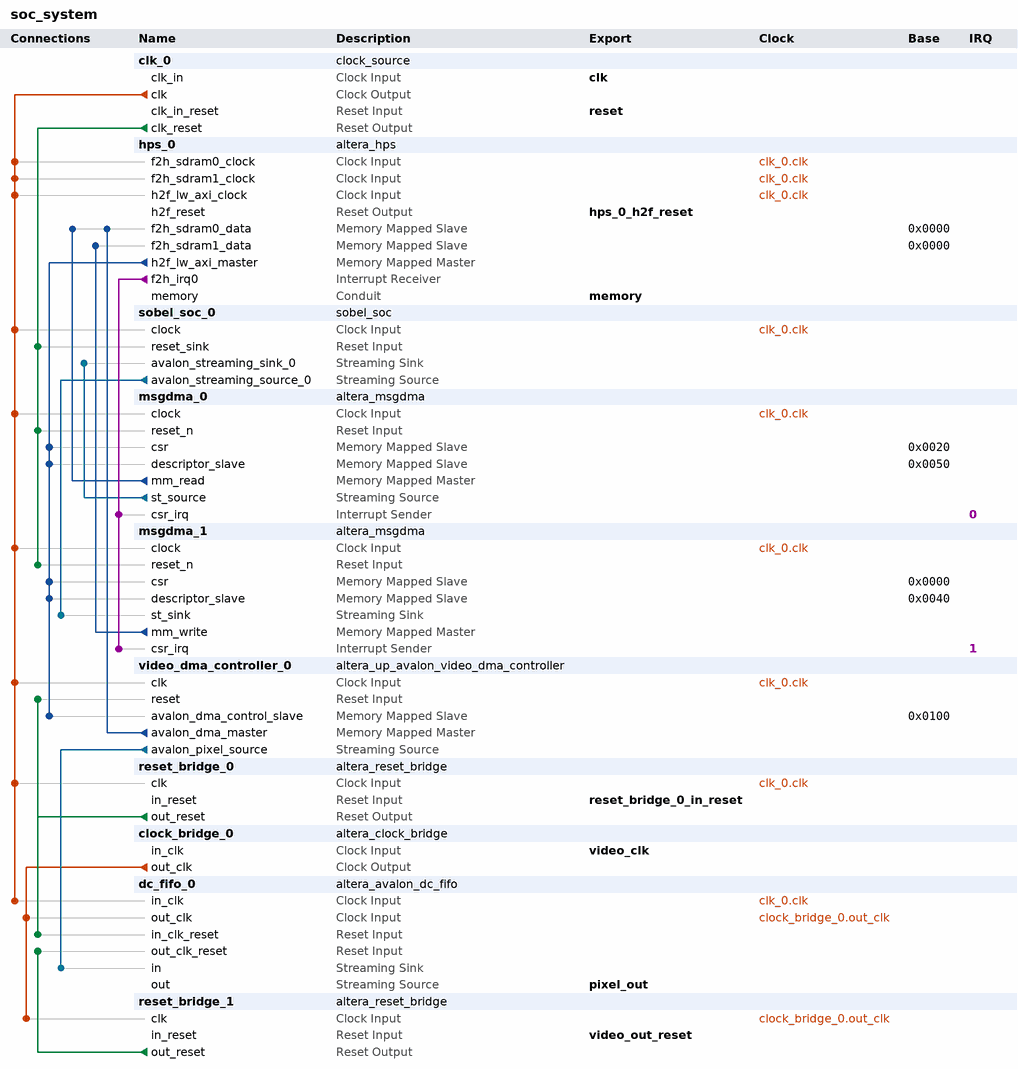
[diagram p0: system contents]
# Platform Designer (Qsys) system soc_system, Cyclone V 5CSEBA6U23I7
# Parameters at their usual value, and those the tool derives, are not listed.
package require -exact qsys 20.1
create_system soc_system
set_project_property DEVICE_FAMILY {Cyclone V}
set_project_property DEVICE 5CSEBA6U23I7

add_instance clk_0 clock_source 20.1
set_instance_parameter_value clk_0 clockFrequency 50000000

add_instance hps_0 altera_hps 20.1
set_instance_parameter_value hps_0 EMAC1_Mode N/A
set_instance_parameter_value hps_0 EMAC1_PinMuxing Unused
set_instance_parameter_value hps_0 F2SCLK_COLDRST_Enable false
set_instance_parameter_value hps_0 F2SCLK_DBGRST_Enable false
set_instance_parameter_value hps_0 F2SCLK_WARMRST_Enable false
set_instance_parameter_value hps_0 F2SDRAM_Type {Avalon-MM Read-Only,Avalon-MM Write-Only}
set_instance_parameter_value hps_0 F2SDRAM_Width 256,256
set_instance_parameter_value hps_0 F2SINTERRUPT_Enable true
set_instance_parameter_value hps_0 F2S_Width 0
set_instance_parameter_value hps_0 FPGA_PERIPHERAL_OUTPUT_CLOCK_FREQ_EMAC0_GTX_CLK 125
set_instance_parameter_value hps_0 FPGA_PERIPHERAL_OUTPUT_CLOCK_FREQ_EMAC0_MD_CLK 2.5
set_instance_parameter_value hps_0 FPGA_PERIPHERAL_OUTPUT_CLOCK_FREQ_EMAC1_GTX_CLK 125
set_instance_parameter_value hps_0 FPGA_PERIPHERAL_OUTPUT_CLOCK_FREQ_EMAC1_MD_CLK 2.5
set_instance_parameter_value hps_0 HPS_PROTOCOL DDR3
set_instance_parameter_value hps_0 I2C0_Mode N/A
set_instance_parameter_value hps_0 I2C0_PinMuxing Unused
set_instance_parameter_value hps_0 I2C1_Mode N/A
set_instance_parameter_value hps_0 I2C1_PinMuxing Unused
set_instance_parameter_value hps_0 LWH2F_Enable true
set_instance_parameter_value hps_0 MEM_BANKADDR_WIDTH 3
set_instance_parameter_value hps_0 MEM_CLK_FREQ 300.0
set_instance_parameter_value hps_0 MEM_COL_ADDR_WIDTH 10
set_instance_parameter_value hps_0 MEM_DQ_WIDTH 32
set_instance_parameter_value hps_0 MEM_DRV_STR RZQ/6
set_instance_parameter_value hps_0 MEM_ROW_ADDR_WIDTH 15
set_instance_parameter_value hps_0 MEM_RTT_NOM RZQ/6
set_instance_parameter_value hps_0 MEM_RTT_WR {Dynamic ODT off}
set_instance_parameter_value hps_0 MEM_TCL 7
set_instance_parameter_value hps_0 MEM_TFAW_NS 37.5
set_instance_parameter_value hps_0 MEM_TINIT_US 499
set_instance_parameter_value hps_0 MEM_TMRD_CK 3
set_instance_parameter_value hps_0 MEM_TRAS_NS 40.0
set_instance_parameter_value hps_0 MEM_TRCD_NS 15.0
set_instance_parameter_value hps_0 MEM_TREFI_US 7.0
set_instance_parameter_value hps_0 MEM_TRFC_NS 75.0
set_instance_parameter_value hps_0 MEM_TRP_NS 15.0
set_instance_parameter_value hps_0 MEM_TWTR 2
set_instance_parameter_value hps_0 MEM_VENDOR Other
set_instance_parameter_value hps_0 MEM_WTCL 6
set_instance_parameter_value hps_0 QSPI_Mode N/A
set_instance_parameter_value hps_0 QSPI_PinMuxing Unused
set_instance_parameter_value hps_0 REF_CLK_FREQ 125.0
set_instance_parameter_value hps_0 S2FCLK_USER2CLK 5
set_instance_parameter_value hps_0 S2F_Width 0
set_instance_parameter_value hps_0 SDIO_Mode N/A
set_instance_parameter_value hps_0 SDIO_PinMuxing Unused
set_instance_parameter_value hps_0 SPIM1_Mode N/A
set_instance_parameter_value hps_0 SPIM1_PinMuxing Unused
set_instance_parameter_value hps_0 STM_Enable false
set_instance_parameter_value hps_0 TIMING_BOARD_AC_SKEW 0.02
set_instance_parameter_value hps_0 TIMING_BOARD_AC_TO_CK_SKEW 0.0
set_instance_parameter_value hps_0 TIMING_BOARD_DQ_TO_DQS_SKEW 0.0
set_instance_parameter_value hps_0 TIMING_BOARD_MAX_CK_DELAY 0.6
set_instance_parameter_value hps_0 TIMING_BOARD_MAX_DQS_DELAY 0.6
set_instance_parameter_value hps_0 TIMING_BOARD_SKEW_BETWEEN_DQS 0.02
set_instance_parameter_value hps_0 TIMING_BOARD_SKEW_CKDQS_DIMM_MAX 0.01
set_instance_parameter_value hps_0 TIMING_BOARD_SKEW_CKDQS_DIMM_MIN -0.01
set_instance_parameter_value hps_0 TIMING_BOARD_SKEW_WITHIN_DQS 0.02
set_instance_parameter_value hps_0 TIMING_TDH 125
set_instance_parameter_value hps_0 TIMING_TDQSCK 400
set_instance_parameter_value hps_0 TIMING_TDQSQ 120
set_instance_parameter_value hps_0 TIMING_TDS 50
set_instance_parameter_value hps_0 TIMING_TIH 250
set_instance_parameter_value hps_0 TIMING_TIS 175
set_instance_parameter_value hps_0 TIMING_TQSH 0.38
set_instance_parameter_value hps_0 UART0_Mode N/A
set_instance_parameter_value hps_0 UART0_PinMuxing Unused
set_instance_parameter_value hps_0 USB1_Mode N/A
set_instance_parameter_value hps_0 USB1_PinMuxing Unused
set_instance_parameter_value hps_0 desired_cfg_clk_mhz 100.0
set_instance_parameter_value hps_0 desired_qspi_clk_mhz 400.0

add_instance sobel_soc_0 sobel_soc 1.0
set_instance_parameter_value sobel_soc_0 PARALLEL_PIXELS 32

add_instance msgdma_0 altera_msgdma 20.1
set_instance_parameter_value msgdma_0 BURST_ENABLE 1
set_instance_parameter_value msgdma_0 DATA_FIFO_DEPTH 32
set_instance_parameter_value msgdma_0 DATA_WIDTH 256
set_instance_parameter_value msgdma_0 DESCRIPTOR_FIFO_DEPTH 128
set_instance_parameter_value msgdma_0 ENHANCED_FEATURES 0
set_instance_parameter_value msgdma_0 ERROR_ENABLE 0
set_instance_parameter_value msgdma_0 MAX_BURST_COUNT 8
set_instance_parameter_value msgdma_0 MAX_BYTE 1048576
set_instance_parameter_value msgdma_0 MODE 1
set_instance_parameter_value msgdma_0 PACKET_ENABLE 0
set_instance_parameter_value msgdma_0 TRANSFER_TYPE {Full Word Accesses Only}

add_instance msgdma_1 altera_msgdma 20.1
set_instance_parameter_value msgdma_1 BURST_ENABLE 1
set_instance_parameter_value msgdma_1 DATA_FIFO_DEPTH 32
set_instance_parameter_value msgdma_1 DATA_WIDTH 256
set_instance_parameter_value msgdma_1 DESCRIPTOR_FIFO_DEPTH 128
set_instance_parameter_value msgdma_1 ENHANCED_FEATURES 0
set_instance_parameter_value msgdma_1 ERROR_ENABLE 0
set_instance_parameter_value msgdma_1 MAX_BURST_COUNT 8
set_instance_parameter_value msgdma_1 MAX_BYTE 1048576
set_instance_parameter_value msgdma_1 MODE 2
set_instance_parameter_value msgdma_1 PACKET_ENABLE 0
set_instance_parameter_value msgdma_1 TRANSFER_TYPE {Full Word Accesses Only}

add_instance video_dma_controller_0 altera_up_avalon_video_dma_controller 18.0
set_instance_parameter_value video_dma_controller_0 addr_mode Consecutive
set_instance_parameter_value video_dma_controller_0 back_start_address 822083584
set_instance_parameter_value video_dma_controller_0 color_bits 8
set_instance_parameter_value video_dma_controller_0 color_planes 1
set_instance_parameter_value video_dma_controller_0 dma_enabled true
set_instance_parameter_value video_dma_controller_0 height 480
set_instance_parameter_value video_dma_controller_0 mode {From Memory to Stream}
set_instance_parameter_value video_dma_controller_0 start_address 822083584
set_instance_parameter_value video_dma_controller_0 width 640

add_instance reset_bridge_0 altera_reset_bridge 20.1
set_instance_parameter_value reset_bridge_0 ACTIVE_LOW_RESET 0
set_instance_parameter_value reset_bridge_0 SYNCHRONOUS_EDGES deassert

add_instance clock_bridge_0 altera_clock_bridge 20.1
set_instance_parameter_value clock_bridge_0 DERIVED_CLOCK_RATE 0
set_instance_parameter_value clock_bridge_0 EXPLICIT_CLOCK_RATE 0

add_instance dc_fifo_0 altera_avalon_dc_fifo 20.1
set_instance_parameter_value dc_fifo_0 BITS_PER_SYMBOL 8
set_instance_parameter_value dc_fifo_0 FIFO_DEPTH 2048
set_instance_parameter_value dc_fifo_0 USE_PACKETS 1

add_instance reset_bridge_1 altera_reset_bridge 20.1
set_instance_parameter_value reset_bridge_1 ACTIVE_LOW_RESET 0
set_instance_parameter_value reset_bridge_1 SYNCHRONOUS_EDGES deassert

# connections
add_connection clk_0.clk dc_fifo_0.in_clk clock
add_connection clk_0.clk hps_0.f2h_sdram0_clock clock
add_connection clk_0.clk hps_0.f2h_sdram1_clock clock
add_connection clk_0.clk hps_0.h2f_lw_axi_clock clock
add_connection clk_0.clk msgdma_0.clock clock
add_connection clk_0.clk msgdma_1.clock clock
add_connection clk_0.clk reset_bridge_0.clk clock
add_connection clk_0.clk sobel_soc_0.clock clock
add_connection clk_0.clk video_dma_controller_0.clk clock
add_connection clock_bridge_0.out_clk dc_fifo_0.out_clk clock
add_connection clock_bridge_0.out_clk reset_bridge_1.clk clock
add_connection clk_0.clk_reset msgdma_0.reset_n reset
add_connection clk_0.clk_reset msgdma_1.reset_n reset
add_connection clk_0.clk_reset sobel_soc_0.reset_sink reset
add_connection reset_bridge_0.out_reset dc_fifo_0.in_clk_reset reset
add_connection reset_bridge_0.out_reset video_dma_controller_0.reset reset
add_connection reset_bridge_1.out_reset dc_fifo_0.out_clk_reset reset
add_connection hps_0.h2f_lw_axi_master msgdma_0.csr avalon
set_connection_parameter_value hps_0.h2f_lw_axi_master/msgdma_0.csr baseAddress 0x0020
add_connection hps_0.h2f_lw_axi_master msgdma_0.descriptor_slave avalon
set_connection_parameter_value hps_0.h2f_lw_axi_master/msgdma_0.descriptor_slave baseAddress 0x0050
add_connection hps_0.h2f_lw_axi_master msgdma_1.csr avalon
set_connection_parameter_value hps_0.h2f_lw_axi_master/msgdma_1.csr baseAddress 0x0000
add_connection hps_0.h2f_lw_axi_master msgdma_1.descriptor_slave avalon
set_connection_parameter_value hps_0.h2f_lw_axi_master/msgdma_1.descriptor_slave baseAddress 0x0040
add_connection hps_0.h2f_lw_axi_master video_dma_controller_0.avalon_dma_control_slave avalon
set_connection_parameter_value hps_0.h2f_lw_axi_master/video_dma_controller_0.avalon_dma_control_slave baseAddress 0x0100
add_connection msgdma_0.mm_read hps_0.f2h_sdram0_data avalon
set_connection_parameter_value msgdma_0.mm_read/hps_0.f2h_sdram0_data baseAddress 0x0000
add_connection msgdma_1.mm_write hps_0.f2h_sdram1_data avalon
set_connection_parameter_value msgdma_1.mm_write/hps_0.f2h_sdram1_data baseAddress 0x0000
add_connection video_dma_controller_0.avalon_dma_master hps_0.f2h_sdram0_data avalon
set_connection_parameter_value video_dma_controller_0.avalon_dma_master/hps_0.f2h_sdram0_data baseAddress 0x0000
add_connection msgdma_0.st_source sobel_soc_0.avalon_streaming_sink_0 avalon_streaming
add_connection sobel_soc_0.avalon_streaming_source_0 msgdma_1.st_sink avalon_streaming
add_connection video_dma_controller_0.avalon_pixel_source dc_fifo_0.in avalon_streaming
add_connection hps_0.f2h_irq0 msgdma_0.csr_irq interrupt
set_connection_parameter_value hps_0.f2h_irq0/msgdma_0.csr_irq irqNumber 0
add_connection hps_0.f2h_irq0 msgdma_1.csr_irq interrupt
set_connection_parameter_value hps_0.f2h_irq0/msgdma_1.csr_irq irqNumber 1

# exported interfaces
add_interface clk clock sink
set_interface_property clk EXPORT_OF clk_0.clk_in
add_interface hps_0_h2f_reset reset source
set_interface_property hps_0_h2f_reset EXPORT_OF hps_0.h2f_reset
add_interface memory conduit end
set_interface_property memory EXPORT_OF hps_0.memory
add_interface pixel_out avalon_streaming source
set_interface_property pixel_out EXPORT_OF dc_fifo_0.out
add_interface reset reset sink
set_interface_property reset EXPORT_OF clk_0.clk_in_reset
add_interface reset_bridge_0_in_reset reset sink
set_interface_property reset_bridge_0_in_reset EXPORT_OF reset_bridge_0.in_reset
add_interface video_clk clock sink
set_interface_property video_clk EXPORT_OF clock_bridge_0.in_clk
add_interface video_out_reset reset sink
set_interface_property video_out_reset EXPORT_OF reset_bridge_1.in_reset

set_interconnect_requirement {$system} qsys_mm.clockCrossingAdapter HANDSHAKE
set_interconnect_requirement {$system} qsys_mm.enableEccProtection FALSE
set_interconnect_requirement {$system} qsys_mm.insertDefaultSlave FALSE
set_interconnect_requirement {$system} qsys_mm.maxAdditionalLatency 1

save_system soc_system.qsys
